# EAGLE schematic MCU v14 (EAGLE 9.7.0)
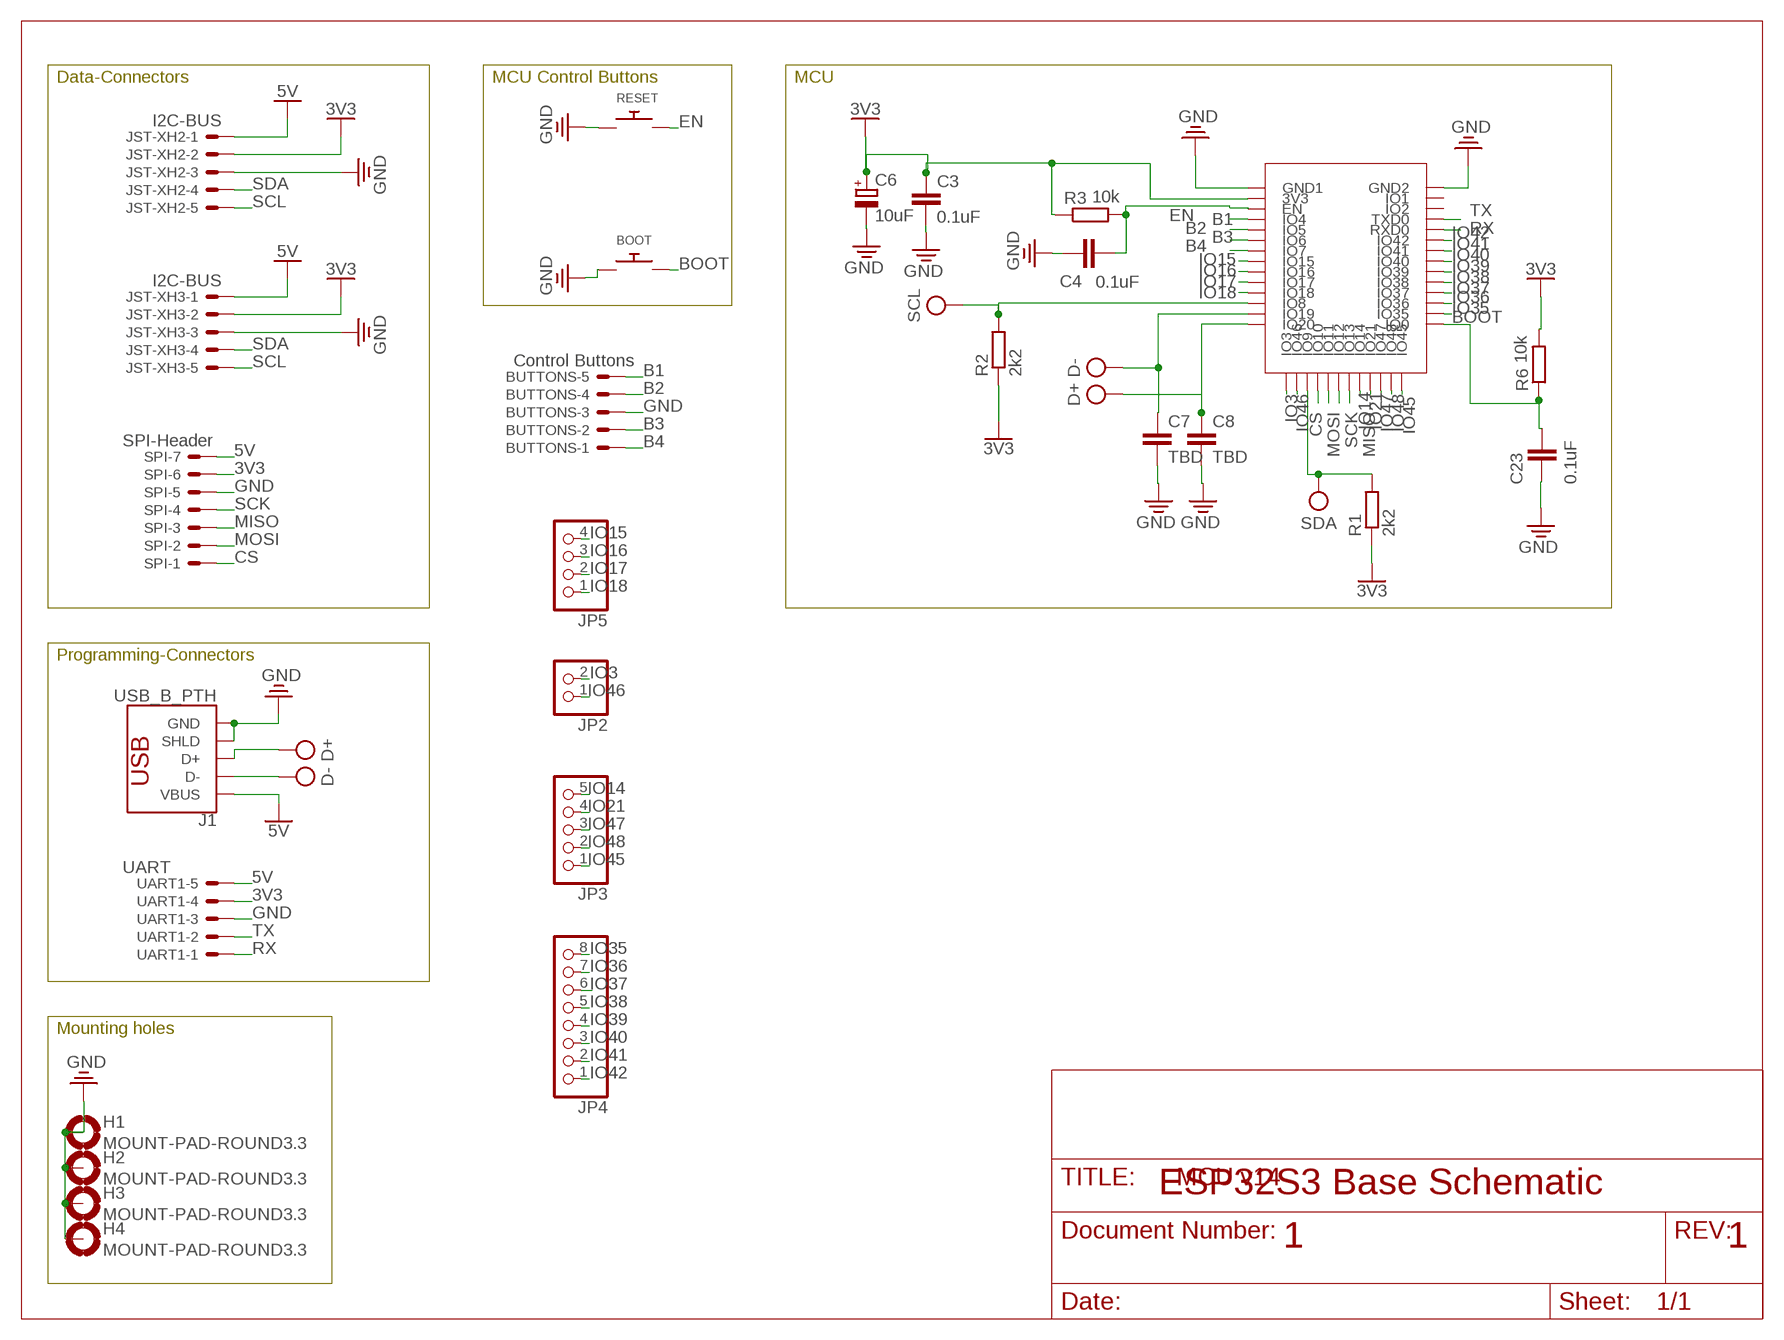
[diagram p0: schematic, sheet 1]

## Parts
BOOT  SWITCH_PUSHBUTTONEVQ-PE  [TACT_PANA-EVQ]
BUTTONS  Control Buttons  JST-XH-05-PIN-LONG-PAD  [JST-XH-05-PACKAGE-LONG-PAD]
C3  0.1uF  C-EU025-030X050  [C025-030X050]
C4  0.1uF  C-EU025-030X050  [C025-030X050]
C6  10uF  C-POL_RADIAL-11MM-DIA  [CAPPRD508W65D1000H1100B]
C7  TBD  C-EU025-030X050  [C025-030X050]
C8  TBD  C-EU025-030X050  [C025-030X050]
C23  0.1uF  C-EU025-030X050  [C025-030X050]
H1  MOUNT-PAD-ROUND3.3  [3,3-PAD]
H2  MOUNT-PAD-ROUND3.3  [3,3-PAD]
H3  MOUNT-PAD-ROUND3.3  [3,3-PAD]
H4  MOUNT-PAD-ROUND3.3  [3,3-PAD]
J1  USB_B_PTH  [USB-B-PTH]
JP2  PINHD-1X2  [1X02]
JP3  PINHD-1X55X2MM  [1_05X2MM]
JP4  PINHD-1X8  [1X08]
JP5  PINHD-1X4  [1X04]
JST-XH2  I2C-BUS  JST-XH-05-PIN-LONG-PAD  [JST-XH-05-PACKAGE-LONG-PAD]
JST-XH3  I2C-BUS  JST-XH-05-PIN-LONG-PAD  [JST-XH-05-PACKAGE-LONG-PAD]
R1  2k2  R-EU_0204/5  [0204/5]
R2  2k2  R-EU_0204/5  [0204/5]
R3  10k  R-EU_0204/7  [0204/7]
R6  10k  R-EU_0204/7  [0204/7]
RESET  SWITCH_PUSHBUTTONEVQ-PE  [TACT_PANA-EVQ]
SPI  SPI-Header  JST-XH-07-PIN-LONG-PAD  [JST-XH-07-PACKAGE-LONG-PAD]
U$1  ESP32-S3-WROOM-1  [ESP32-S3-WROOM-1]
UART1  UART  JST-XH-05-PIN-ROUND-PAD  [JST-XH-05-PACKAGE-ROUND-PAD]

## Nets
3V3: C3.1 C6.1(+) JST-XH2.2 JST-XH3.2 R1.1 R2.1 R3.1 R6.2 SPI.6 U$1.3V3 UART1.4
5V: J1.VBUS JST-XH2.1 JST-XH3.1 SPI.7 UART1.5
B1: BUTTONS.5 U$1.IO4
B2: BUTTONS.4 U$1.IO5
B3: BUTTONS.2 U$1.IO6
B4: BUTTONS.1 U$1.IO7
BOOT: BOOT.P$2 C23.2 R6.1 U$1.IO0
CS: SPI.1 U$1.IO10
D+: C8.1 J1.D+ U$1.IO20
D-: C7.1 J1.D- U$1.IO19
EN: C4.2 R3.2 RESET.P$2 U$1.EN
GND: BOOT.P$1 BUTTONS.3 C3.2 C4.1 C6.2(-) C7.2 C8.2 C23.1 H1.B3,3(MOUNT) H2.B3,3(MOUNT) H3.B3,3(MOUNT) H4.B3,3(MOUNT) J1.GND J1.SHLD1(SHLD) J1.SHLD2(SHLD) JST-XH2.3 JST-XH3.3 RESET.P$1 SPI.5 U$1.GND1 U$1.GND2 UART1.3
IO3: JP2.2 U$1.IO3
IO14: JP3.5 U$1.IO14
IO15: JP5.4 U$1.IO15
IO16: JP5.3 U$1.IO16
IO17: JP5.2 U$1.IO17
IO18: JP5.1 U$1.IO18
IO21: JP3.4 U$1.IO21
IO35: JP4.8 U$1.IO35
IO36: JP4.7 U$1.IO36
IO37: JP4.6 U$1.IO37
IO38: JP4.5 U$1.IO38
IO39: JP4.4 U$1.IO39
IO40: JP4.3 U$1.IO40
IO41: JP4.2 U$1.IO41
IO42: JP4.1 U$1.IO42
IO45: JP3.1 U$1.IO45
IO46: JP2.1 U$1.IO46
IO47: JP3.3 U$1.IO47
IO48: JP3.2 U$1.IO48
MISO: SPI.3 U$1.IO13
MOSI: SPI.2 U$1.IO11
RX: U$1.RXD0 UART1.1
SCK: SPI.4 U$1.IO12
SCL: JST-XH2.5 JST-XH3.5 R2.2 U$1.IO8
SDA: JST-XH2.4 JST-XH3.4 R1.2 U$1.IO9
TX: U$1.TXD0 UART1.2
Unconnected: U$1.IO1 U$1.IO2

## Notes on the sheet
- Data-Connectors | MCU Control Buttons | MCU
- Programming-Connectors
- Mounting holes
- ESP32S3 Base Schematic
- 1 | 1

## Library data of the parts
BOOT RESET = adafruit:SWITCH_PUSHBUTTON: Buttons SOFTTOUCHSMD_SJ - Soft touch temporary push button (Super Junk Akihabara) Compatible with SKPMANE010 [Mouser: 688-SKPMAN] C&K_KSS = Digikey: KSS221GLFS
BUTTONS JST-XH2 JST-XH3 UART1 = Rembrandt Electronics - JST XH Connectors v1-0:JST-XH-05-PIN: JST XH Connector 2 Pin Wire to board connector. Pitch: 2,54 mm, (0.100") Number of pins: 5 Created by Rembrandt Electronics www.rembrandtelectronics.com
C3 C4 C7 C8 C23 = rcl:C-EU: CAPACITOR, European symbol; SPICEPREFIX: C
C6 = Capacitor:C-POL: Capacitor Polarised - Generic; CATEGORY: Capacitor
H1-H4 = holes:MOUNT-PAD-ROUND: MOUNTING PAD, round
J1 = SparkFun-Connectors:USB_B: USB Type B Connector SparkFun Products: SparkFun Stepoko <https://www.sparkfun.com/products/13899> PTH; PROD_ID: CONN-08278; SF_ID: PRT-00139
JP2 = pinhead:PINHD-1X2: PIN HEADER
JP3 = pinhead:PINHD-1X5: PIN HEADER
JP4 = pinhead:PINHD-1X8: PIN HEADER
JP5 = pinhead:PINHD-1X4: PIN HEADER
R1-R3 R6 = rcl:R-EU_: RESISTOR, European symbol; SPICEPREFIX: R
SPI = Rembrandt Electronics - JST XH Connectors v1-0:JST-XH-07-PIN: JST XH Connector 2 Pin Wire to board connector. Pitch: 2,54 mm, (0.100") Number of pins: 7 Created by Rembrandt Electronics www.rembrandtelectronics.com
U$1 = RobotMower_Eagle_Library:ESP32-S3-WROOM-1